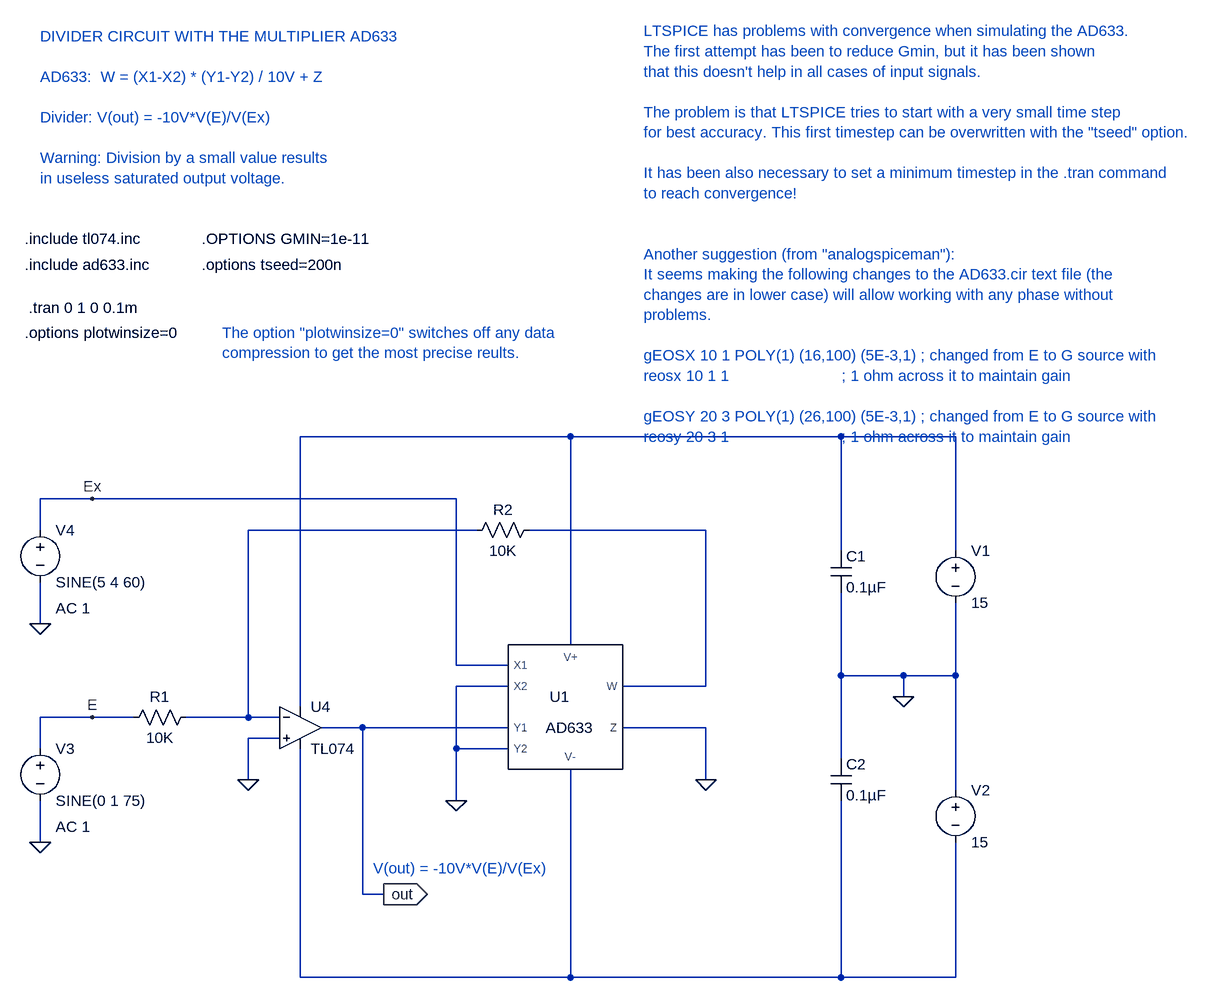
[diagram p0: schematic ad633_conv_test.asc]
ad633_conv_test.asc, the LTspice schematic file:
Version 4
SHEET 1 1348 836
WIRE 880 464 880 288
WIRE 800 320 800 288
WIRE 800 288 704 288
WIRE 880 288 880 176
WIRE 880 96 880 -80
WIRE 880 -80 704 -80
WIRE -128 -80 -128 336
WIRE -128 400 -128 752
WIRE -128 752 288 752
WIRE 880 752 880 544
WIRE 288 -80 -128 -80
WIRE 368 368 496 368
WIRE 496 368 496 448
WIRE -208 448 -208 384
WIRE -208 384 -160 384
WIRE -304 352 -208 352
WIRE -208 352 -208 64
WIRE -208 352 -160 352
WIRE -208 64 144 64
WIRE 224 64 496 64
WIRE 496 64 496 304
WIRE 496 304 368 304
WIRE -528 544 -528 480
WIRE -528 400 -528 352
WIRE -528 352 -448 352
WIRE 192 304 112 304
WIRE 112 304 112 400
WIRE 192 400 112 400
WIRE 112 400 112 480
WIRE -96 368 -32 368
WIRE -32 368 192 368
WIRE -528 208 -528 144
WIRE -528 64 -528 16
WIRE -528 16 -448 16
WIRE 112 16 112 272
WIRE 112 272 192 272
WIRE 704 -80 704 96
WIRE 704 160 704 288
WIRE 704 480 704 752
WIRE 704 -80 288 -80
WIRE 704 752 880 752
WIRE 704 416 704 288
WIRE 800 288 880 288
WIRE 288 752 288 432
WIRE 288 752 704 752
WIRE -448 16 112 16
WIRE -448 352 -384 352
WIRE -32 624 0 624
WIRE -32 624 -32 368
WIRE 288 240 288 -80
FLAG 800 320 0
FLAG 496 448 0
FLAG -208 448 0
FLAG -528 544 0
FLAG 112 480 0
FLAG 0 624 out
IOPIN 0 624 Out
FLAG -528 208 0
FLAG -448 16 Ex
FLAG -448 352 E
SYMBOL voltage 880 80 R0
WINDOW 123 0 0 Left 0
WINDOW 39 0 0 Left 0
SYMATTR InstName V1
SYMATTR Value 15
SYMBOL voltage 880 448 R0
WINDOW 123 0 0 Left 0
WINDOW 39 0 0 Left 0
SYMATTR InstName V2
SYMATTR Value 15
SYMBOL res -288 336 R90
WINDOW 0 0 56 VBottom 0
WINDOW 3 32 56 VTop 0
SYMATTR InstName R1
SYMATTR Value 10K
SYMBOL res 240 48 R90
WINDOW 0 0 56 VBottom 0
WINDOW 3 32 56 VTop 0
SYMATTR InstName R2
SYMATTR Value 10K
SYMBOL voltage -528 384 R0
WINDOW 123 24 136 Left 0
WINDOW 39 0 0 Left 0
SYMATTR Value2 AC 1
SYMATTR InstName V3
SYMATTR Value SINE(0 1 75)
SYMBOL voltage -528 48 R0
WINDOW 123 24 136 Left 0
WINDOW 39 0 0 Left 0
SYMATTR Value2 AC 1
SYMATTR InstName V4
SYMATTR Value SINE(5 4 60)
SYMBOL cap 688 96 R0
SYMATTR InstName C1
SYMATTR Value 0.1µF
SYMBOL cap 688 416 R0
SYMATTR InstName C2
SYMATTR Value 0.1µF
SYMBOL Opamps\\opamp2 -128 304 R0
SYMATTR InstName U4
SYMATTR Value TL074
SYMBOL ad633 288 336 R0
SYMATTR InstName U1
TEXT -546 -278 Left 0 !.tran 0 1 0 0.1m
TEXT -552 -384 Left 0 !.include tl074.inc
TEXT -552 -344 Left 0 !.include ad633.inc
TEXT -280 -344 Left 0 !.options tseed=200n
TEXT -280 -384 Left 0 !.OPTIONS GMIN=1e-11
TEXT -16 584 Left 0 ;V(out) = -10V*V(E)/V(Ex)
TEXT -552 -240 Left 0 !.options plotwinsize=0
TEXT 400 -704 Left 0 ;LTSPICE has problems with convergence when simulating the AD633.\nThe first attempt has been to reduce Gmin, but it has been shown\nthat this doesn't help in all cases of input signals.\n \nThe problem is that LTSPICE tries to start with a very small time step\nfor best accuracy. This first timestep can be overwritten with the "tseed" option.\n \nIt has been also necessary to set a minimum timestep in the .tran command\nto reach convergence!\n \n \nAnother suggestion (from "analogspiceman"):\nIt seems making the following changes to the AD633.cir text file (the \nchanges are in lower case) will allow working with any phase without \nproblems.\n \ngEOSX 10 1 POLY(1) (16,100) (5E-3,1) ; changed from E to G source with\nreosx 10 1 1                         ; 1 ohm across it to maintain gain\n \ngEOSY 20 3 POLY(1) (26,100) (5E-3,1) ; changed from E to G source with\nreosy 20 3 1                         ; 1 ohm across it to maintain gain
TEXT -248 -240 Left 0 ;The option "plotwinsize=0" switches off any data \ncompression to get the most precise reults.
TEXT -528 -696 Left 0 ;DIVIDER CIRCUIT WITH THE MULTIPLIER AD633\n \nAD633:  W = (X1-X2) * (Y1-Y2) / 10V + Z\n \nDivider: V(out) = -10V*V(E)/V(Ex)\n \nWarning: Division by a small value results\nin useless saturated output voltage.

The netlist it stands for:
* ad633_conv_test.asc
V1 N001 0 15
V2 0 N002 15
R1 N003 E 10K
R2 N004 N003 10K
V3 E 0 SINE(0 1 75) AC 1
V4 Ex 0 SINE(5 4 60) AC 1
C1 N001 0 0.1µF
C2 0 N002 0.1µF
XU4 0 N003 N001 N002 out TL074  ; pins In+ In- V+ V- OUT
XU1 Ex 0 out 0 N002 0 N004 N001 AD633  ; pins X1 X2 Y1 Y2 V- Z W V+
.tran 0 1 0 0.1m
.include tl074.inc
.include ad633.inc
.options tseed=200n
.OPTIONS GMIN=1e-11
* V(out) = -10V*V(E)/V(Ex)
.options plotwinsize=0
* LTSPICE has problems with convergence when simulating the AD633.
* The first attempt has been to reduce Gmin, but it has been shown
* that this doesn't help in all cases of input signals.
* The problem is that LTSPICE tries to start with a very small time step
* for best accuracy. This first timestep can be overwritten with the "tseed" option.
* It has been also necessary to set a minimum timestep in the .tran command
* to reach convergence!
* Another suggestion (from "analogspiceman"):
* It seems making the following changes to the AD633.cir text file (the
* changes are in lower case) will allow working with any phase without
* problems.
* gEOSX 10 1 POLY(1) (16,100) (5E-3,1) ; changed from E to G source with
* reosx 10 1 1                         ; 1 ohm across it to maintain gain
* gEOSY 20 3 POLY(1) (26,100) (5E-3,1) ; changed from E to G source with
* reosy 20 3 1                         ; 1 ohm across it to maintain gain
* The option "plotwinsize=0" switches off any data
* compression to get the most precise reults.
* DIVIDER CIRCUIT WITH THE MULTIPLIER AD633
* AD633:  W = (X1-X2) * (Y1-Y2) / 10V + Z
* Divider: V(out) = -10V*V(E)/V(Ex)
* Warning: Division by a small value results
* in useless saturated output voltage.
.backanno
.end